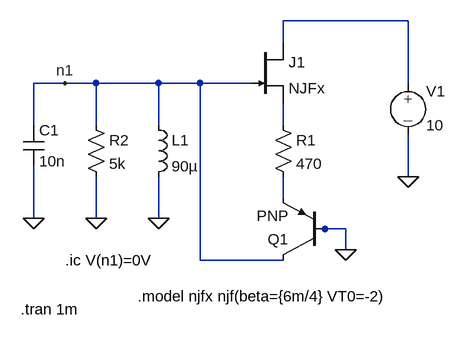
[diagram p0: schematic Klausur_9.3.asc]
Klausur_9.3.asc, the LTspice schematic file:
Version 4
SHEET 1 880 680
WIRE 336 160 144 160
WIRE 144 192 144 160
WIRE -192 256 -240 256
WIRE -144 256 -192 256
WIRE -48 256 -144 256
WIRE 16 256 -48 256
WIRE 96 256 16 256
WIRE 336 256 336 160
WIRE -240 320 -240 256
WIRE -144 320 -144 256
WIRE -48 320 -48 256
WIRE 144 320 144 288
WIRE 336 400 336 336
WIRE 144 432 144 400
WIRE -240 464 -240 384
WIRE -144 464 -144 400
WIRE -48 464 -48 400
WIRE 208 480 192 480
WIRE 240 480 208 480
WIRE 240 512 240 480
WIRE 16 528 16 256
WIRE 144 528 16 528
FLAG 336 400 0
FLAG 240 512 0
FLAG -48 464 0
FLAG -144 464 0
FLAG -240 464 0
FLAG -192 256 n1
SYMBOL source-V 336 240 R0
WINDOW 123 0 0 Left 0
WINDOW 39 0 0 Left 0
SYMATTR InstName V1
SYMATTR Value 10
SYMBOL EIT_Semiconductors\\njf 96 192 R0
SYMATTR InstName J1
SYMATTR Value NJFx
SYMBOL EIT_Semiconductors\\pnp 208 528 R180
SYMATTR InstName Q1
SYMBOL res 128 304 R0
SYMATTR InstName R1
SYMATTR Value 470
SYMBOL res -160 304 R0
SYMATTR InstName R2
SYMATTR Value 5k
SYMBOL ind -64 304 R0
SYMATTR InstName L1
SYMATTR Value 90µ
SYMBOL cap -256 320 R0
SYMATTR InstName C1
SYMATTR Value 10n
TEXT -80 584 Left 0 !.model njfx njf(beta={6m/4} VT0=-2)
TEXT -260 604 Left 0 !.tran 1m
TEXT -192 528 Left 0 !.ic V(n1)=0V

The netlist it stands for:
* Klausur_9.3.asc
V1 N001 0 10
J1 N001 n1 N002 NJFx
Q1 n1 0 N003 0 PNP
R1 N002 N003 470
R2 n1 0 5k
L1 n1 0 90µ
C1 n1 0 10n
.model NPN NPN
.model PNP PNP
.lib standard.bjt
.model NJF NJF
.model PJF PJF
.lib standard.jft
.model njfx njf(beta={6m/4} VT0=-2)
.tran 1m
.ic V(n1)=0V
.backanno
.end